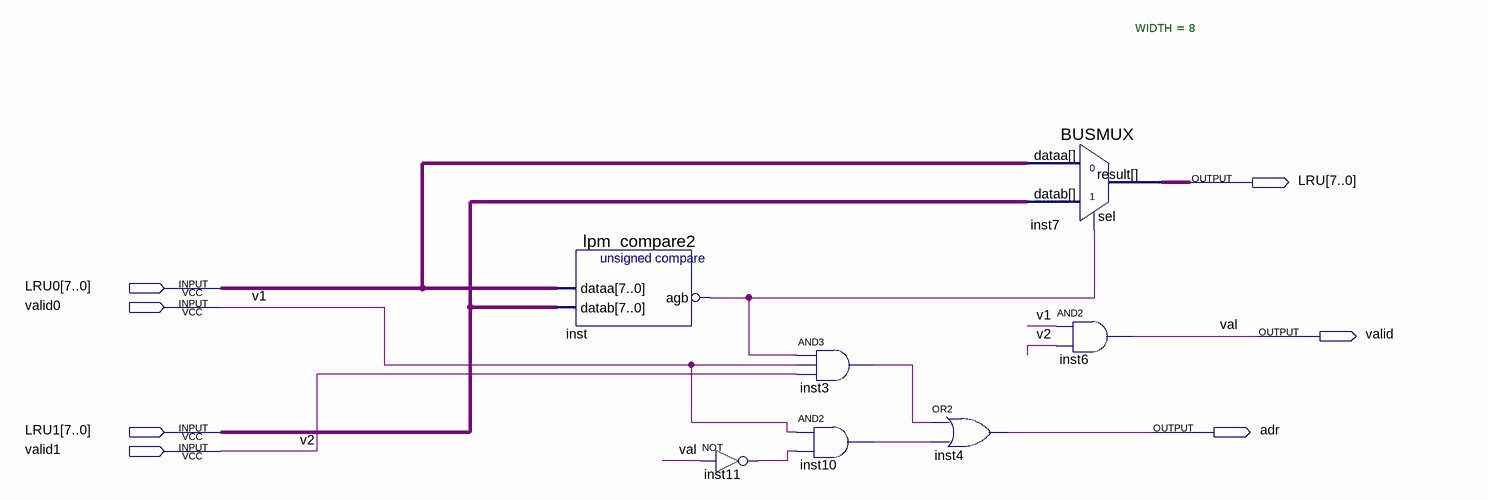
[diagram p0: schematic sheet]
// Quartus schematic Block5.bdf as structural Verilog: 7 symbols, 7 pins
module Block5 (
  input  [7:0] LRU0,
  input  valid0,
  input  [7:0] LRU1,
  input  valid1,
  output [7:0] LRU,
  output valid,
  output adr
);

  wire inst3_out, inst10_out, inst11_out, inst_agb, inst_agb_inverted_out;

  lpm_compare2 inst (.dataa(LRU0), .datab(LRU1), .agb(inst_agb));
  not inst_agb_inverted (inst_agb_inverted_out, inst_agb);
  not inst11 (inst11_out, valid);
  and inst3 (inst3_out, inst_agb_inverted_out, valid0, valid1);
  and inst10 (inst10_out, valid0, inst11_out);
  or inst4 (adr, inst3_out, inst10_out);
  BUSMUX #(.WIDTH(8)) inst7 (.datab(LRU1), .sel(inst_agb_inverted_out), .dataa(LRU0), .result(LRU));
  and inst6 (valid, valid0, valid1);

  // Other names for the same wires on the sheet: v1 = valid0; v2 = valid1; val = valid
endmodule
